# EAGLE design radiomatrix (EAGLE 6.2)
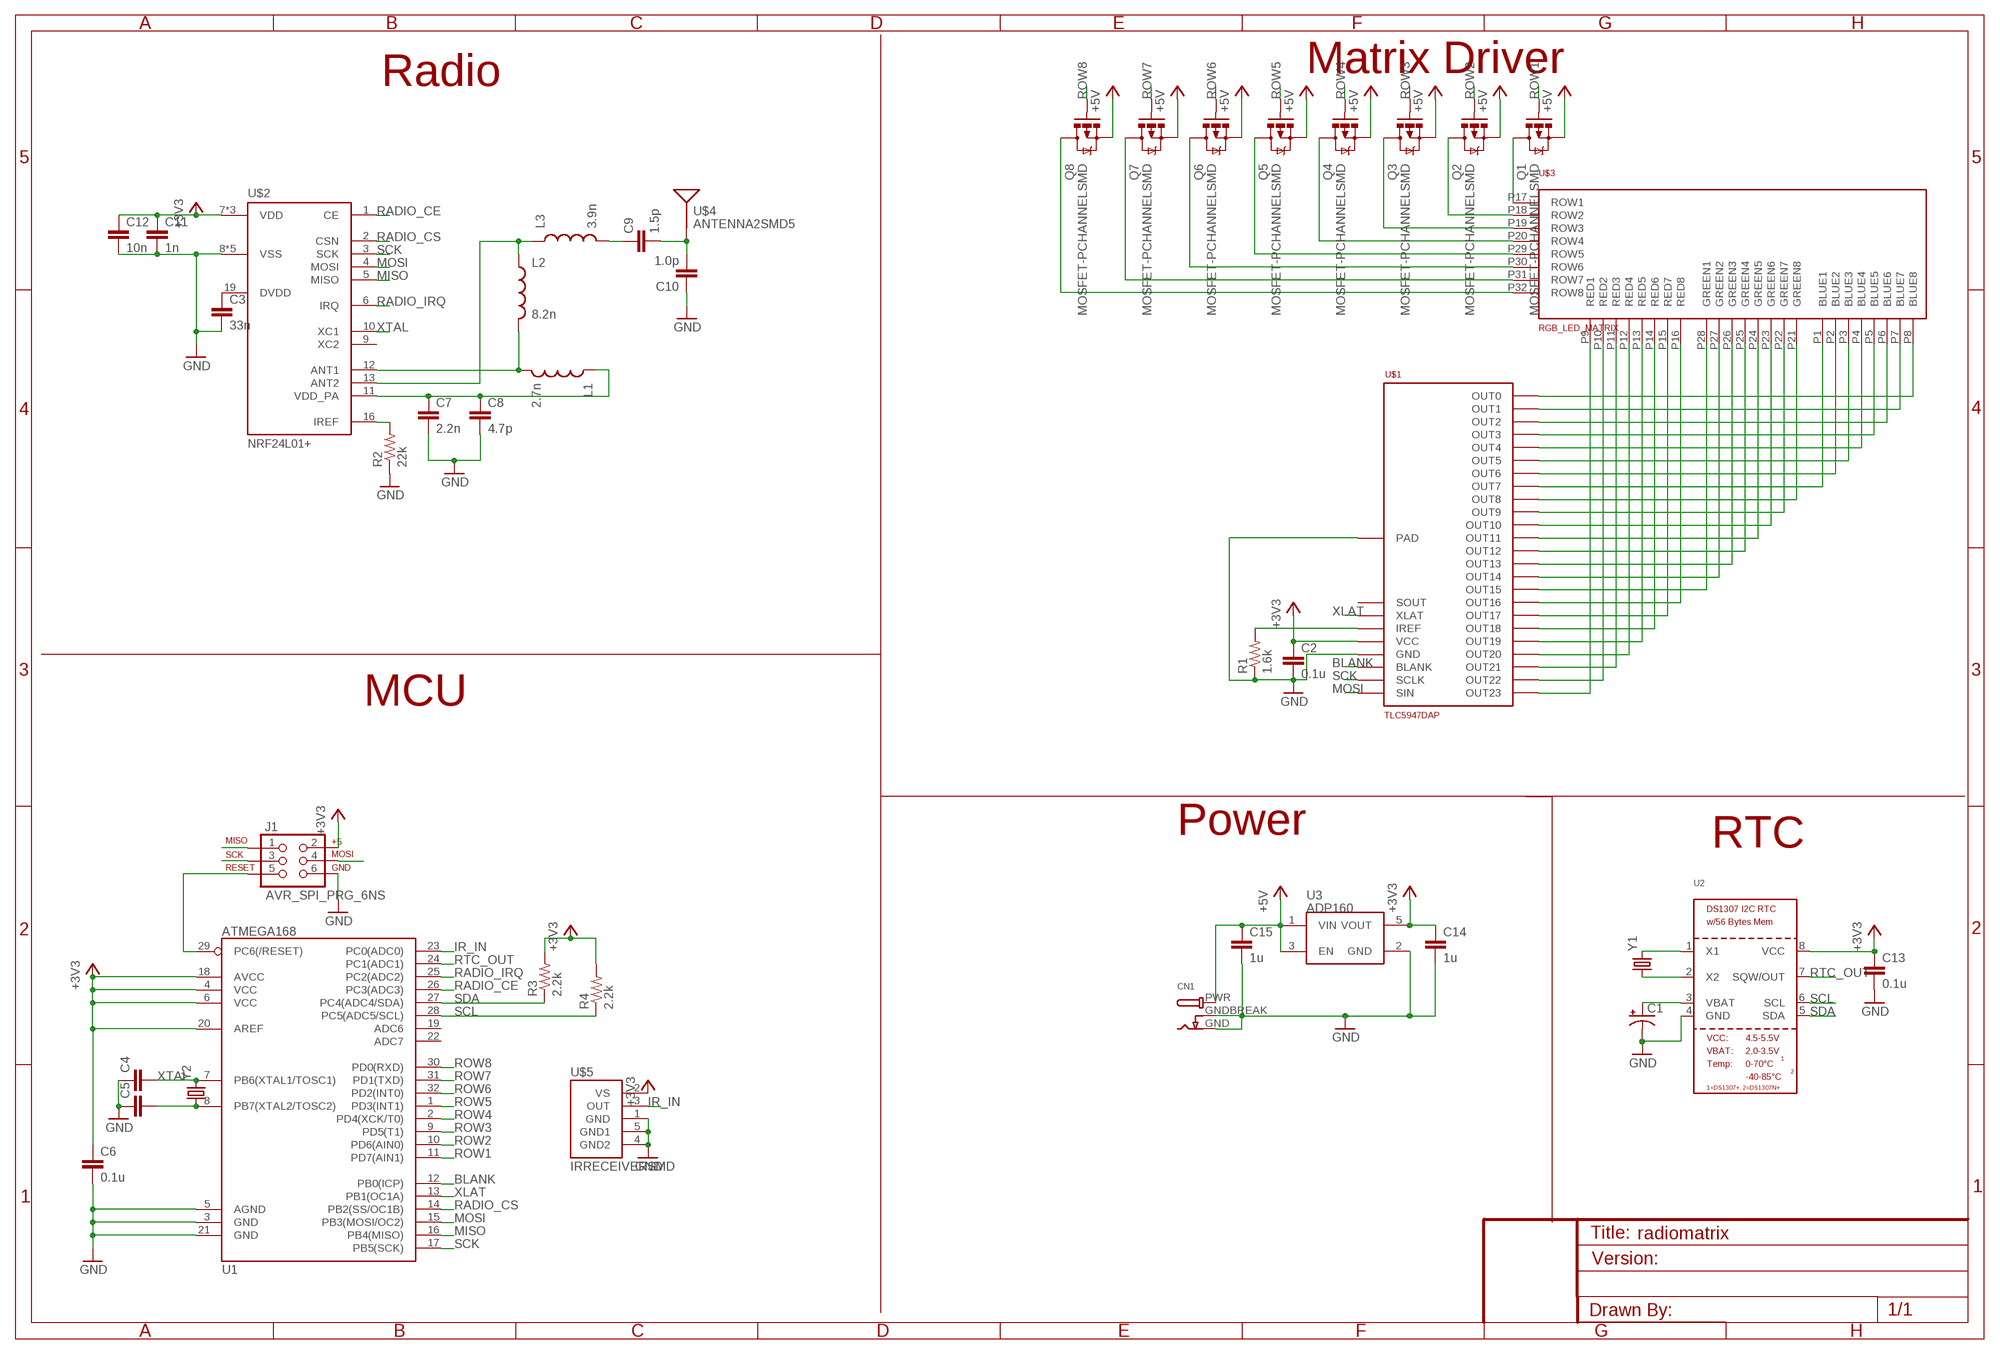
[diagram p0: schematic, sheet 1]

## Parts
C1  SUPERCAP  [414-VA5R]
C2  0.1u  CAP0603-CAP  [0603-CAP]
C3  33n  CAP0603-CAP  [0603-CAP]
C4  CAP0603-CAP  [0603-CAP]
C5  CAP0603-CAP  [0603-CAP]
C6  0.1u  CAP0603-CAP  [0603-CAP]
C7  2.2n  CAP0603-CAP  [0603-CAP]
C8  4.7p  CAP0603-CAP  [0603-CAP]
C9  1.5p  CAP0603-CAP  [0603-CAP]
C10  1.0p  CAP0603-CAP  [0603-CAP]
C11  1n  CAP0603-CAP  [0603-CAP]
C12  10n  CAP0603-CAP  [0603-CAP]
C13  0.1u  CAP0603-CAP  [0603-CAP]
C14  1u  CAP0603-CAP  [0603-CAP]
C15  1u  CAP0603-CAP  [0603-CAP]
CN1  DCBARREL1.3MM  [DCJACK_1.3MM_PTH]
J1  AVR_SPI_PRG_6NS  [2X3-NS]
L1  2.7n  INDUCTOR0603  [0603]
L2  8.2n  INDUCTOR0603  [0603]
L3  3.9n  INDUCTOR0603  [0603]
Q1  MOSFET-PCHANNELSMD  [SOT23-3]
Q2  MOSFET-PCHANNELSMD  [SOT23-3]
Q3  MOSFET-PCHANNELSMD  [SOT23-3]
Q4  MOSFET-PCHANNELSMD  [SOT23-3]
Q5  MOSFET-PCHANNELSMD  [SOT23-3]
Q6  MOSFET-PCHANNELSMD  [SOT23-3]
Q7  MOSFET-PCHANNELSMD  [SOT23-3]
Q8  MOSFET-PCHANNELSMD  [SOT23-3]
R1  1.6k  RESISTOR0603-RES  [0603-RES]
R2  22k  RESISTOR0603-RES  [0603-RES]
R3  2.2k  RESISTOR0603-RES  [0603-RES]
R4  2.2k  RESISTOR0603-RES  [0603-RES]
U1  ATMEGA168  [TQFP32-08]
U2  RTC_DS1307  [SOIC8_150MIL]
U3  ADP160  [SOT23-5]
U$1  TLC5947DAP  [HTSSOP32DAP]
U$2  NRF24L01+  [QFN20]
U$3  RGB_LED_MATRIX  [RGB_LED_MATRIX_60MM]
U$4  ANTENNA2SMD5  [ANTENNA-CHIP5]
U$5  IRRECEIVERSMD  [TSOP8523]
Y1  CRYSTAL32-SMD  [CRYSTAL-32KHZ-SMD]
Y2  CRYSTAL5X3  [CRYSTAL-SMD-5X3]

## Nets
+3V3: C2.1 C6.1 C11.1 C12.1 C13.1 C14.1 J1.2 R3.2 R4.2 U1.4(VCC) U1.6(VCC) U1.18(AVCC) U1.20(AREF) U2.8(VCC) U3.5(VOUT) U$1.32(VCC) U$2.7(VDD) U$2.15(VDD) U$2.18(VDD) U$5.2(VS)
+5V: C15.1 CN1.PWR Q1.2(S) Q2.2(S) Q3.2(S) Q4.2(S) Q5.2(S) Q6.2(S) Q7.2(S) Q8.2(S) U3.1(VIN) U3.3(EN)
ANT1: L1.2 L2.2 U$2.12(ANT1)
ANT2: L2.1 L3.1 U$2.13(ANT2)
ANT2B: C9.1 L3.2
ANT2C: C9.2 C10.2 U$4.FEED(SIGNAL)
BLANK: U1.12(PB0(ICP)) U$1.2(BLANK)
BLUE1: U$1.12(OUT7) U$3.P1(BLUE1)
BLUE2: U$1.11(OUT6) U$3.P2(BLUE2)
BLUE3: U$1.10(OUT5) U$3.P3(BLUE3)
BLUE4: U$1.9(OUT4) U$3.P4(BLUE4)
BLUE5: U$1.8(OUT3) U$3.P5(BLUE5)
BLUE6: U$1.7(OUT2) U$3.P6(BLUE6)
BLUE7: U$1.6(OUT1) U$3.P7(BLUE7)
BLUE8: U$1.5(OUT0) U$3.P8(BLUE8)
GND: C1.- C2.2 C3.2 C4.1 C5.1 C6.2 C7.2 C8.2 C10.1 C11.2 C12.2 C13.2 C14.2 C15.2 CN1.GND CN1.GNDBREAK J1.6 R1.1 R2.1 U1.3(GND) U1.5(AGND) U1.21(GND) U2.4(GND) U3.2(GND) U$1.1(GND) U$1.EXP(PAD) U$2.8(VSS) U$2.14(VSS) U$2.17(VSS) U$2.20(VSS) U$2.EXP(VSS) U$5.1(GND) U$5.4(GND2) U$5.5(GND1)
GREEN1: U$1.20(OUT15) U$3.P28(GREEN1)
GREEN2: U$1.19(OUT14) U$3.P27(GREEN2)
GREEN3: U$1.18(OUT13) U$3.P26(GREEN3)
GREEN4: U$1.17(OUT12) U$3.P25(GREEN4)
GREEN5: U$1.16(OUT11) U$3.P24(GREEN5)
GREEN6: U$1.15(OUT10) U$3.P23(GREEN6)
GREEN7: U$1.14(OUT9) U$3.P22(GREEN7)
GREEN8: U$1.13(OUT8) U$3.P21(GREEN8)
IR_IN: U1.23(PC0(ADC0)) U$5.3(OUT)
MISO: J1.1 U1.16(PB4(MISO)) U$2.5(MISO)
MOSI: J1.4 U1.15(PB3(MOSI/OC2)) U$1.4(SIN) U$2.4(MOSI)
N$1: C1.+ U2.3(VBAT)
N$2: U2.2(X2) Y1.X1
N$3: U2.1(X1) Y1.X2
N$36: R1.2 U$1.31(IREF)
N$37: C3.1 U$2.19(DVDD)
N$38: C7.1 C8.1 L1.1 U$2.11(VDD_PA)
N$39: C5.2 U1.8(PB7(XTAL2/TOSC2)) Y2.1
N$40: J1.5 U1.29(PC6(/RESET))
N$46: R2.2 U$2.16(IREF)
R1: Q1.3(D) U$3.P17(ROW1)
R2: Q2.3(D) U$3.P18(ROW2)
R3: Q3.3(D) U$3.P19(ROW3)
R4: Q4.3(D) U$3.P20(ROW4)
R5: Q5.3(D) U$3.P29(ROW5)
R6: Q6.3(D) U$3.P30(ROW6)
R7: Q7.3(D) U$3.P31(ROW7)
R8: Q8.3(D) U$3.P32(ROW8)
RADIO_CE: U1.26(PC3(ADC3)) U$2.1(CE)
RADIO_CS: U1.14(PB2(SS/OC1B)) U$2.2(CSN)
RADIO_IRQ: U1.25(PC2(ADC2)) U$2.6(IRQ)
RED1: U$1.28(OUT23) U$3.P9(RED1)
RED2: U$1.27(OUT22) U$3.P10(RED2)
RED3: U$1.26(OUT21) U$3.P11(RED3)
RED4: U$1.25(OUT20) U$3.P12(RED4)
RED5: U$1.24(OUT19) U$3.P13(RED5)
RED6: U$1.23(OUT18) U$3.P14(RED6)
RED7: U$1.22(OUT17) U$3.P15(RED7)
RED8: U$1.21(OUT16) U$3.P16(RED8)
ROW1: Q1.1(G) U1.11(PD7(AIN1))
ROW2: Q2.1(G) U1.10(PD6(AIN0))
ROW3: Q3.1(G) U1.9(PD5(T1))
ROW4: Q4.1(G) U1.2(PD4(XCK/T0))
ROW5: Q5.1(G) U1.1(PD3(INT1))
ROW6: Q6.1(G) U1.32(PD2(INT0))
ROW7: Q7.1(G) U1.31(PD1(TXD))
ROW8: Q8.1(G) U1.30(PD0(RXD))
RTC_OUT: U1.24(PC1(ADC1)) U2.7(SQW/OUT)
SCK: J1.3 U1.17(PB5(SCK)) U$1.3(SCLK) U$2.3(SCK)
SCL: R4.1 U1.28(PC5(ADC5/SCL)) U2.6(SCL)
SDA: R3.1 U1.27(PC4(ADC4/SDA)) U2.5(SDA)
XLAT: U1.13(PB1(OC1A)) U$1.30(XLAT)
XTAL: C4.2 U1.7(PB6(XTAL1/TOSC1)) U$2.10(XC1) Y2.3
Unconnected: U1.19(ADC6) U1.22(ADC7) U$1.29(SOUT) U$2.9(XC2)

## Notes on the sheet
- Radio | Matrix Driver
- MCU
- Power | RTC

## Library data of the parts
C1 = adafruit:SUPERCAP
C2-C15 = SparkFun-Passives:CAP: Capacitor Standard 0603 ceramic capacitor, and 0.1" leaded capacitor.
CN1 = microbuilder:DCBARREL: DC Barrel Jack DCJACK_1.3MM_PTH - Through Hole 1.3mm Jack (4UConnector: 05536) DCJACK_2MM_PTH - Through Hole 2.0/2.1 Jack (4UConnector: 05537) DCJACK_2MM_SMT - SMT 2.0/2.1mm Jack(4UConnector: 03267)
J1 = SparkFun-Connectors:AVR_SPI_PRG_6: AVR ISP 6 Pin This is the reduced ISP connector for AVR programming. Common on Arduino. This footprint will take up less PCB space and can be used with a 10-pin to 6-pin adapter such as SKU: BOB-08508
L1-L3 = SparkFun-Passives:INDUCTOR: Inductors Basic Inductor/Choke - 0603 and 1206. Footprints are not proven and vary greatly between part numbers.
Q1-Q8 = SparkFun-DiscreteSemi:MOSFET-PCHANNEL: Generic PMOSFET
R1-R4 = SparkFun-Passives:RESISTOR: Resistor Basic schematic elements and footprints for 0603, 1206, and PTH resistors.
U1 = SparkFun-DigitalIC:ATMEGA168: Atmel 32-pin 8-bit micro, 16k flash.
U2 = microbuilder:RTC_DS1307: DS1307 I2C RTC with 56-Bytes RAM
U3 = SparkFun-PowerIC:ADP160: Nanopower LDO Iq less than 1uA for low Iload; PROD_ID: VREG-11306
U$1 = TLC5947:TLC5947
U$2 = nRF24L01+:NRF24L01+
U$3 = nickparts:RGB_LED_MATRIX
U$4 = SparkFun-RF:ANTENNA2: Chip antenna Single endded antenna. Common with smaller chip antennas. CHIP4 package is the GPS Chip Antenna SKU: GPS-08418. CHIP5 package is 2.4GHz chip antenna SKU: WRL-00144.
U$5 = SparkFun-Sensors:IRRECEIVER: TSOP85238 38kHz IR receiver with built in demodulation and filtering- SEN-08545
Y1 Y2 = SparkFun-FreqCtrl:CRYSTAL: Various standard crystals. Proven footprints. Spark Fun Electronics SKU : COM-00534

## Board
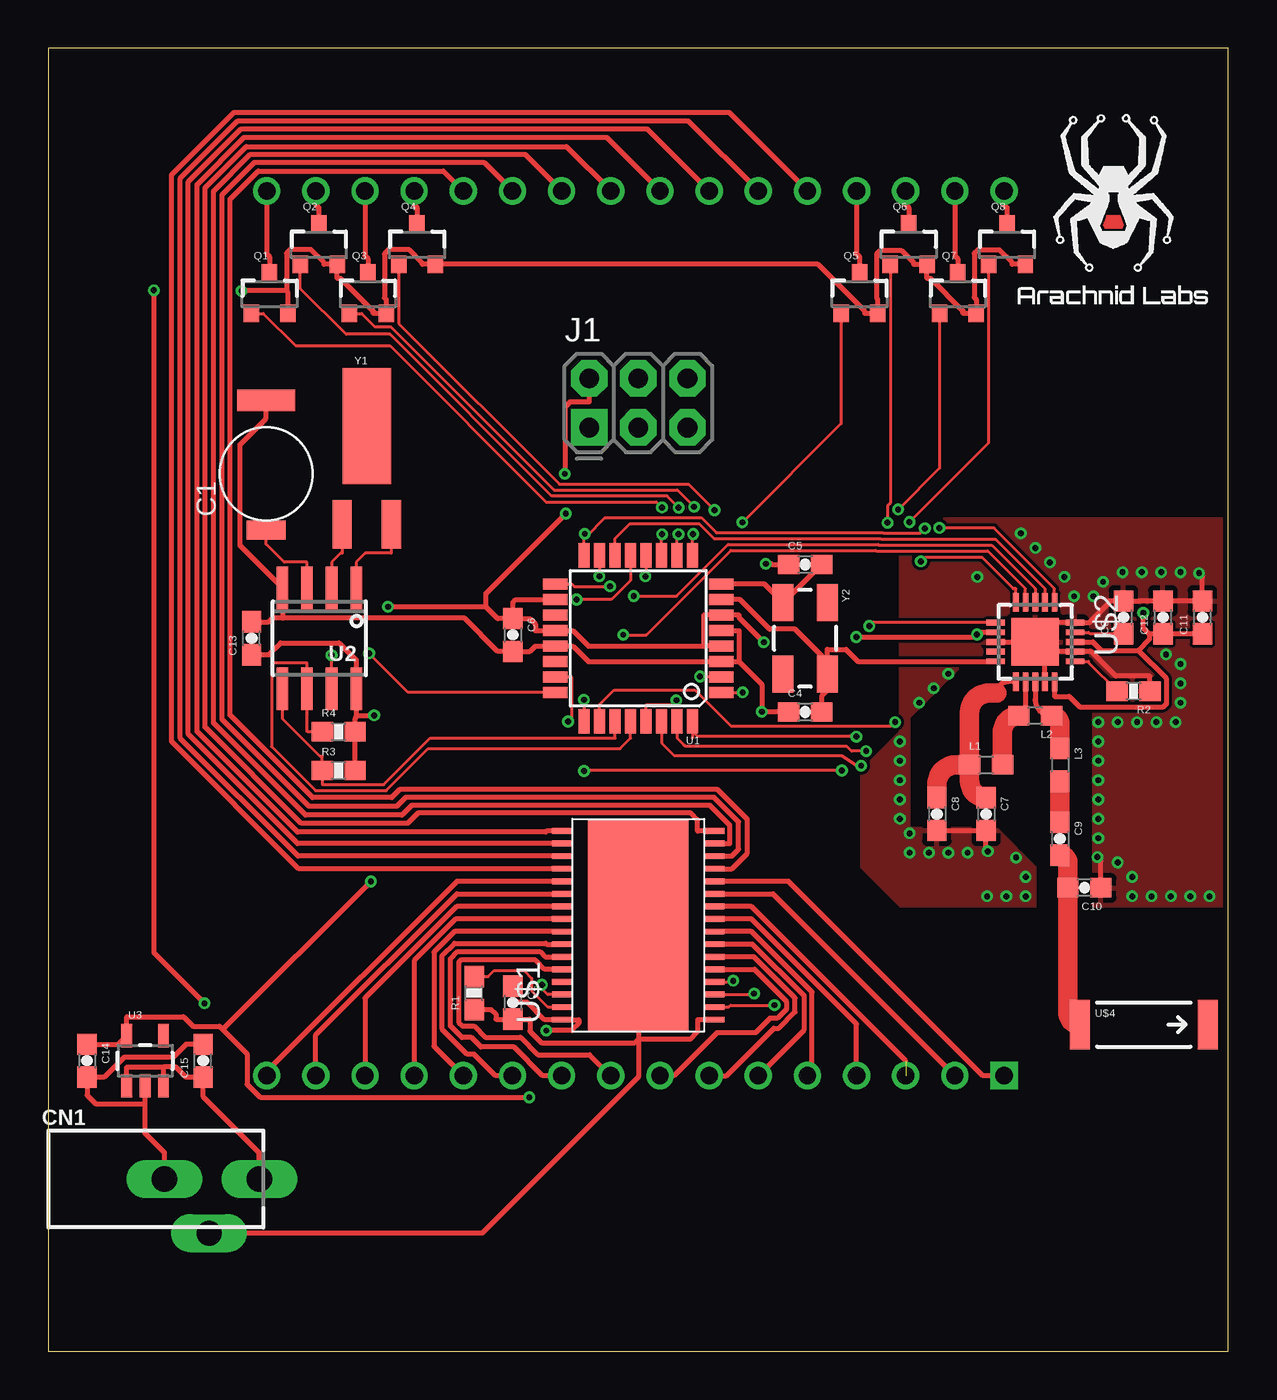
[diagram p1: board, top side]
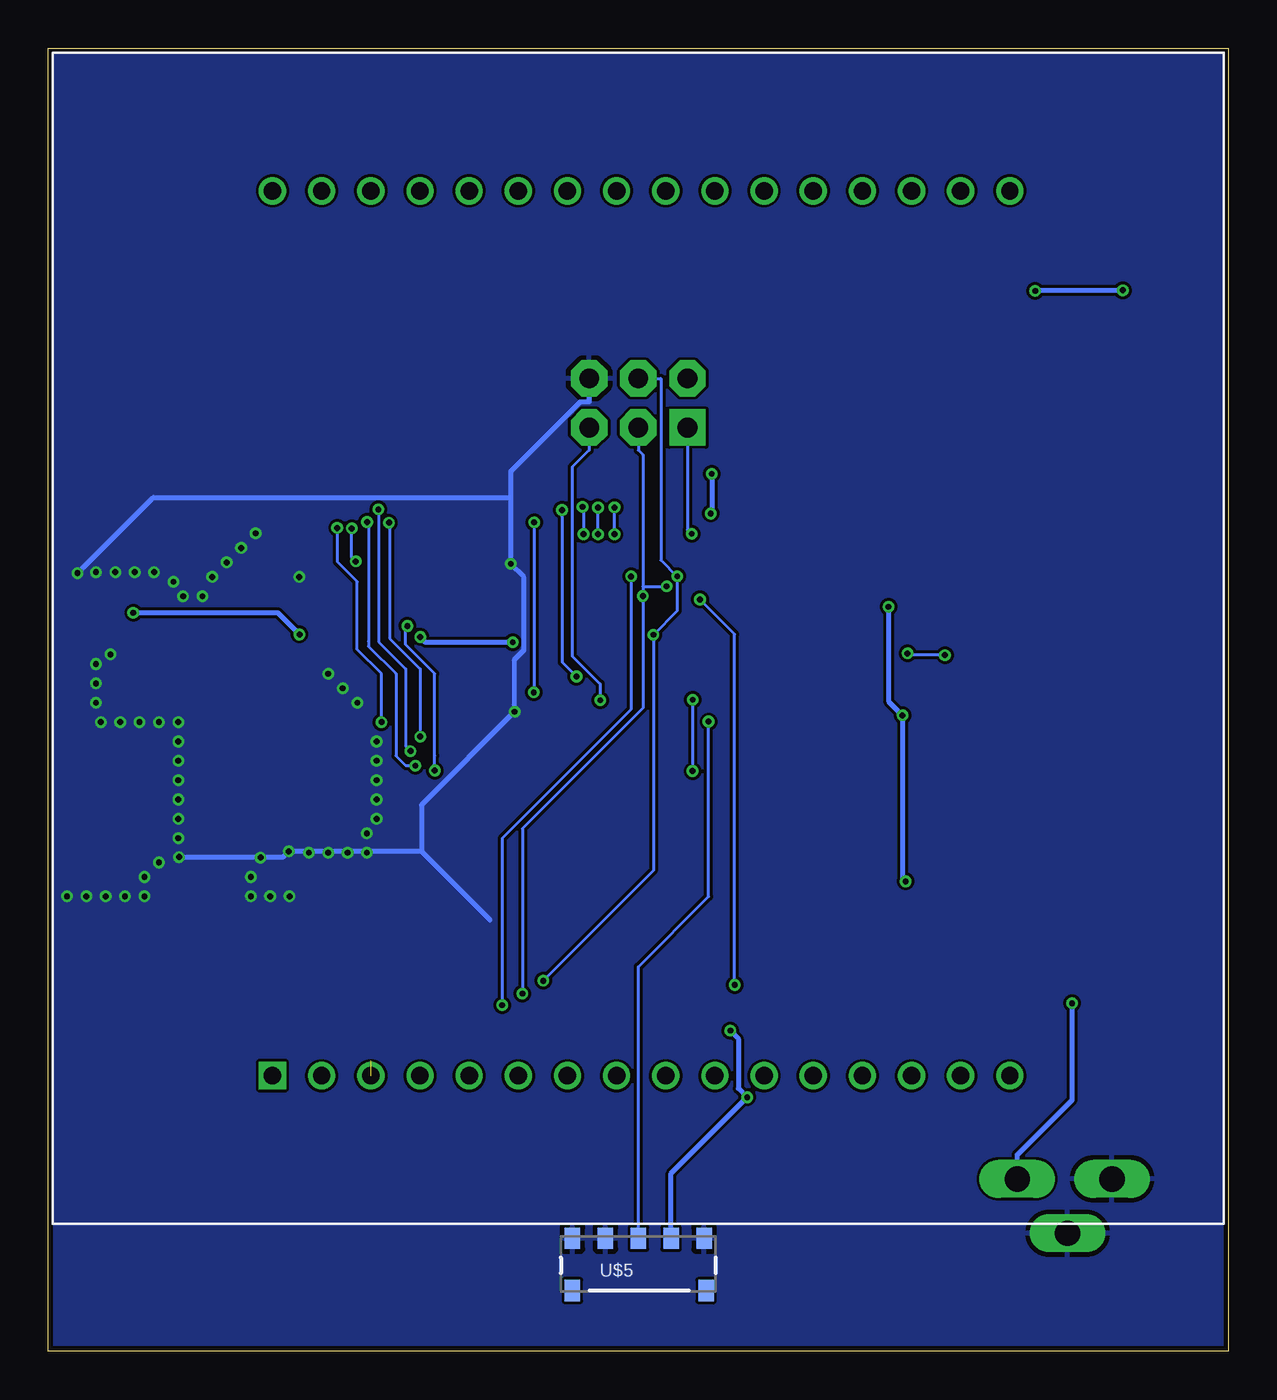
[diagram p2: board, bottom side, seen from below]

Size 60.96 x 67.31 mm. Coordinates in mm from the lower left corner, seen from the top.
Outline: 0,0 60.96,0 60.96,67.31 0,67.31 0,0
Copper layers (1*16): Top 0.035mm / dielectric 1.5mm / Bottom 0.035mm
Design rules: minimum track width 6mil, minimum drill 0.3mm, track to track 6mil, track to pad 6mil, pad to pad 6mil, via to via 6mil, smd to smd 0mil, copper to edge 10mil, drill to drill 10mil, minimum pad ring 10mil, minimum via ring 0.15mm, stop-mask expansion 2mil, vias tented up to drill 100mil, thermal gap 10mil
tKeepout: area 51,0 to 61,23
bKeepout: area 51,0 to 61,23

### Footprints (pad centres in the part's own frame; a part is rotated, then mirrored left to right if it is on the bottom)
414-VA5R = smd 1 x 2: + -2.9,0 | smd 1.1 x 3: - 3.8,0
0603-CAP = smd 1.1 x 1: 1 -0.85,0; 2 0.85,0
DCJACK_1.3MM_PTH = drill 1.3 long: GND 0,6; GNDBREAK 2.8,8.3; PWR 0,10.9
2X3-NS = drill 1.016 pad 1.88 square: 1 -2.54,-1.27 | drill 1.016 pad 1.88 octagon: 2 -2.54,1.27; 3 0,-1.27; 4 0,1.27; 5 2.54,-1.27; 6 2.54,1.27
0603 = smd 1.1 x 1: 1 -0.85,0; 2 0.85,0
SOT23-3 = smd 0.8 x 0.9: 1 -0.95,-1; 2 0.95,-1; 3 0,1.1
0603-RES = smd 1.1 x 1: 1 -0.85,0; 2 0.85,0
TQFP32-08 = smd 1.27 x 0.559: 1 -4.293,2.8; 2 -4.293,2; 3 -4.293,1.2; 4 -4.293,0.4; 5 -4.293,-0.4; 6 -4.293,-1.2; 7 -4.293,-2; 8 -4.293,-2.8; 17 4.293,-2.8; 18 4.293,-2; 19 4.293,-1.2; 20 4.293,-0.4; 21 4.293,0.4; 22 4.293,1.2; 23 4.293,2; 24 4.293,2.8 | smd 0.559 x 1.27: 9 -2.8,-4.293; 10 -2,-4.293; 11 -1.2,-4.293; 12 -0.4,-4.293; 13 0.4,-4.293; 14 1.2,-4.293; 15 2,-4.293; 16 2.8,-4.293; 25 2.8,4.293; 26 2,4.293; 27 1.2,4.293; 28 0.4,4.293; 29 -0.4,4.293; 30 -1.2,4.293; 31 -2,4.293; 32 -2.8,4.293
SOIC8_150MIL = smd 0.6 x 2.2: 1 -1.905,-2.6; 2 -0.635,-2.6; 3 0.635,-2.6; 4 1.905,-2.6; 5 1.905,2.6; 6 0.635,2.6; 7 -0.635,2.6; 8 -1.905,2.6
SOT23-5 = smd 0.55 x 1.2: 1 -0.95,-1.3; 2 0,-1.3; 3 0.95,-1.3; 4 0.95,1.3; 5 -0.95,1.3
HTSSOP32DAP = smd 0.3 x 1: 1 -4.875,-3.95; 2 -4.225,-3.95; 3 -3.575,-3.95; 4 -2.925,-3.95; 5 -2.275,-3.95; 6 -1.625,-3.95; 7 -0.975,-3.95; 8 -0.325,-3.95; 9 0.325,-3.95; 10 0.975,-3.95; 11 1.625,-3.95; 12 2.275,-3.95; 13 2.925,-3.95; 14 3.575,-3.95; 15 4.225,-3.95; 16 4.875,-3.95; 17 4.875,3.95; 18 4.225,3.95; 19 3.575,3.95; 20 2.925,3.95; 21 2.275,3.95; 22 1.625,3.95; 23 0.975,3.95; 24 0.325,3.95; 25 -0.325,3.95; 26 -0.975,3.95; 27 -1.625,3.95; 28 -2.275,3.95; 29 -2.925,3.95; 30 -3.575,3.95; 31 -4.225,3.95; 32 -4.875,3.95 | smd 11 x 5.2: EXP 0,0
QFN20 = smd 0.95 x 0.3: 1 -2.05,1; 2 -2.05,0.5; 3 -2.05,0; 4 -2.05,-0.5; 5 -2.05,-1; 11 2.05,-1; 12 2.05,-0.5; 13 2.05,0; 14 2.05,0.5; 15 2.05,1 | smd 0.3 x 0.95: 6 -1,-2.05; 7 -0.5,-2.05; 8 0,-2.05; 9 0.5,-2.05; 10 1,-2.05; 16 1,2.05; 17 0.5,2.05; 18 0,2.05; 19 -0.5,2.05; 20 -1,2.05 | smd 2.45 x 2.45: EXP 0,0
RGB_LED_MATRIX_60MM = drill 0.9 square: P1 -18.9,-22.6 | drill 0.9: P2 -16.36,-22.6; P3 -13.82,-22.6; P4 -11.28,-22.6; P5 -8.74,-22.6; P6 -6.2,-22.6; P7 -3.66,-22.6; P8 -1.12,-22.6; P9 1.42,-22.6; P10 3.96,-22.6; P11 6.5,-22.6; P12 9.04,-22.6; P13 11.58,-22.6; P14 14.12,-22.6; P15 16.66,-22.6; P16 19.2,-22.6; P17 19.2,23.12; P18 16.66,23.12; P19 14.12,23.12; P20 11.58,23.12; P21 9.04,23.12; P22 6.5,23.12; P23 3.96,23.12; P24 1.42,23.12; P25 -1.12,23.12; P26 -3.66,23.12; P27 -6.2,23.12; P28 -8.74,23.12; P29 -11.28,23.12; P30 -13.82,23.12; P31 -16.36,23.12; P32 -18.9,23.12
ANTENNA-CHIP5 = smd 1.016 x 2.54: FEED -3.302,0; NC 3.302,0
TSOP8523 = smd 0.8 x 1.1: 1 3.4,0; 2 1.7,0; 3 0,0; 4 -1.7,0; 5 -3.4,0; P$1 -3.4,-2.7; P$2 3.5,-2.7
CRYSTAL-32KHZ-SMD = smd 2.5 x 6: SHEILD 0,5.08 | smd 1 x 2.5: X1 -1.27,0; X2 1.27,0
CRYSTAL-SMD-5X3 = smd 1.9 x 1.1: 1 -1.85,-1.15; 2 1.85,-1.15; 3 1.85,1.15; 4 -1.85,1.15

### Placement (x,y rotation side)
C1  11.25,45.32 90 top
C2  24,18 270 top
C3  55.55,37.91 90 top
C4  39.1,33.02 0 top
C5  39.1,40.64 0 top
C6  24,37 270 top
C7  48.45,27.75 270 top
C8  45.91,27.75 270 top
C9  52.26,26.48 270 top
C10  53.53,23.94 180 top
C11  59.63,37.91 90 top
C12  57.59,37.91 90 top
C13  10.5,36.83 90 top
C14  2,15 270 top
C15  8,15 90 top
CN1  0,8.89 270 top
J1  30.48,48.99 0 top
L1  48.45,30.29 0 top
L2  50.99,32.83 180 top
L3  52.26,30.29 270 top
Q1  11.43,54.61 0 top
Q2  13.97,57.15 0 top
Q3  16.51,54.61 0 top
Q4  19.05,57.15 0 top
Q5  41.91,54.61 0 top
Q6  44.45,57.15 0 top
Q7  46.99,54.61 0 top
Q8  49.53,57.15 0 top
R1  22,18.5 90 top
R2  56.07,34.1 180 top
R3  15,30 0 top
R4  15,32 0 top
U1  30.48,36.83 180 top
U2  14,36.83 180 top
U3  5,15 0 top
U$1  30.48,22 90 top
U$2  50.99,36.64 270 top
U$3  30.48,36.83 0 bottom
U$4  56.6,16.87 0 top
U$5  30.48,5.83 0 bottom
U$6  [ARACHNID_LABS_LOGO_SM]  55,59 0 top
Y1  16.45,42.71 0 top
Y2  39.1,36.83 270 top

### Tracks (layer width: path | path; a pad name or v marks a point on that pad's centre or on a via)
+3V3  (via drill 0.3 pad 0.6)
  Top 0.254: 56.89,37.06 56.58,37.37 v56.58,38.15 | 56.89,37.06 56.89,36.79 56.31,36.21 | 56.89,37.06 C12.1 C11.1 | U$2.15 51.99,33.84 52.74,33.84 53.29,33.29 57.62,33.29 57.78,33.45 57.78,34.74 56.31,36.21 | 22.61,38.46 22.61,39.16 v26.74,43.28 | 22.61,38.46 v17.55,38.46 | J1.2 27.94,49.04 26.95,49.04 26.68,48.78 v26.68,45.33 | C6.1 23.22,37.85 22.61,38.46 | C6.1 24,38.68 24.15,38.83 U1.18 | 9.01,16.62 10.26,15.36 10.26,13.79 10.94,13.11 v24.85,13.11 | v16.66,24.27 9.01,16.62 | 15.9,32.85 v16.82,32.85 v16.83,32.85 | 15.9,32.85 U2.8 15.9,35.71 15.02,36.6 12,36.6 11.38,35.98 C13.1 | v36.97,36.62 35.69,37.9 35.69,38.03 U1.6 33.86,38.03 33.86,36.43 | U$2.7 48.1,37.14 v47.98,37.03 47.83,36.87 41.77,36.87 v41.75,36.9 | 33.86,36.43 27.9,36.43 27.1,37.23 U1.20 25.17,37.23 25.17,37.56 24.88,37.85 C6.1 | U1.4 33.86,36.43 | U$2.18 53.97,36.64 54.4,36.21 56.31,36.21 | R3.2 R4.2 15.85,32.69 15.9,32.75 15.9,32.85 | 9.01,16.62 8.84,16.79 7.47,16.79 6.98,17.28 4.05,17.28 U3.5 3.6,15.85 C14.1 | v25.72,16.56 27.03,16.56 27.41,16.94 27.41,17.12 U$1.32 25.65,17.12 24.75,18.02 24,18.02 C2.1
  Bottom 0.254: v56.58,38.15 49.11,38.15 v47.98,37.03 | v26.68,45.33 26.68,43.33 v26.74,43.28 | v17.55,38.46 17.55,33.57 v16.83,32.85 16.83,24.43 v16.66,24.27 | U$5.2 28.78,9.19 v24.85,13.11 25.3,13.56 25.3,16.14 v25.72,16.56 | v36.97,36.62 41.47,36.62 v41.75,36.9
+5V  (via drill 0.3 pad 0.6)
  Top 0.254: v5.44,54.81 5.44,20.59 v8.06,17.97 | 12.3,54.78 v9.97,54.78 | Q1.2 12.38,54.71 12.3,54.78 | 12.3,54.78 12.3,56.73 12.49,56.91 13.56,56.91 14.24,56.23 14.24,56.15 Q2.2 14.92,55.42 15.11,55.42 16.78,53.74 16.78,53.61 Q3.2 17.46,54.34 17.37,54.43 17.37,56.7 17.57,56.9 18.65,56.9 19.32,56.23 19.32,56.15 Q4.2 39.76,56.15 42.18,53.73 42.18,53.61 Q5.2 42.86,54.34 42.82,54.38 42.82,56.72 42.99,56.88 44.07,56.88 44.72,56.23 44.72,56.15 Q6.2 45.4,55.42 45.59,55.42 47.26,53.75 47.26,53.61 Q7.2 47.94,54.34 47.84,54.43 47.84,56.72 48.02,56.89 49.14,56.89 49.8,56.23 49.8,56.15 Q8.2 | CN1.PWR 10.9,10.25 8,13.15 C15.1 7.12,14.15 6.59,14.68 5.95,14.68 | U3.3 5.95,14.68 | U3.1 4.05,14.68 5.95,14.68
  Bottom 0.254: CN1.PWR 10.9,10.14 8.06,12.98 v8.06,17.97 | v9.97,54.78 9.94,54.81 v5.44,54.81
ANT1
  Top 0.254: U$2.12 50.49,33.18 arc-90 L2.2
  Top 1: L2.2 arc90 49.3,31.99 L1.2
ANT2
  Top 0.254: U$2.13 50.99,33.68 arc90 L2.1
  Top 1: L2.1 arc-90 52.26,32.41 L3.1
ANT2B
  Top 1: L3.2 C9.1
ANT2C
  Top 1: C9.2 arc-90 52.68,25.21 C10.2 52.68,17.49 arc90 U$4.FEED
BLANK  (via drill 0.3 pad 0.6)
  Top 0.152: U1.12 30.88,40.06 v30.85,40.03 | U$1.2 35.16,17.77 35.26,17.87 v37.51,17.87
  Bottom 0.152: v30.85,40.03 30.85,33.16 37.51,26.5 v37.51,17.87
BLUE1
  Top 0.254: U$3.P1 48.3,14.23 38.25,24.27 U$1.12
BLUE2
  Top 0.254: U$1.11 37.45,23.62 U$3.P2
BLUE3  (1 unrouted)
  Top 0.254: 44.3,14.99 36.32,22.98 U$1.10
BLUE4
  Top 0.254: U$3.P4 41.76,16.9 36.33,22.32 U$1.9
BLUE5
  Top 0.254: U$3.P5 39.47,14.48 39.47,18.55 36.34,21.68 U$1.8
BLUE6
  Top 0.254: U$3.P6 39.06,16.61 39.06,18.36 36.39,21.02 U$1.7
BLUE7
  Top 0.254: U$3.P7 35.03,14.23 37.49,16.68 37.75,16.68 38.58,17.52 38.58,18.25 36.45,20.38 U$1.6
BLUE8
  Top 0.254: U$1.5 36.48,19.73 38.13,18.08 38.13,17.66 37.67,17.19 37.28,17.19 36.53,16.45 34.54,16.45 32.32,14.23 U$3.P8
GND  (via drill 0.3 pad 0.6)
  Top 0.254: R2.1 56.92,34.88 55.16,34.88 53.9,36.14 U$2.17 51.49,36.14 | v59.45,40.2 59.63,40.02 C11.2 C12.2 56.33,38.76 C3.2 54.77,38.76 54.77,38.62 53.79,37.64 U$2.20 51.99,37.64 U$2.EXP | v37.07,40.68 37.38,40.68 37.42,40.64 C5.1 | 35.69,35.63 36.87,34.45 v36.87,33.04 36.89,33.02 C4.1 | 35.69,35.63 U1.3 27.9,35.63 27.1,36.43 U1.21 25.16,36.43 24.88,36.15 C6.2 23.22,36.15 21.49,37.88 12.13,37.88 12.1,37.91 | U1.5 35.69,37.23 35.69,35.63 | C8.2 C7.2 48.45,25.91 v48.54,25.82 | C10.1 54.38,25.35 v54.21,25.53 | 5,12.78 U3.2 | 51.49,36.14 U$2.EXP | U$2.14 51.49,36.14 | U$2.8 U$2.EXP | 12.1,37.91 U2.4 9.9,41.62 9.9,46.84 11.25,48.19 C1.- | C13.2 11.38,37.68 11.61,37.91 12.1,37.91 | C15.2 7.12,15.85 6.46,15.19 3.92,15.19 2.88,14.15 C14.2 2,13.22 2.44,12.78 5,12.78 | CN1.GND 6,10.25 5,11.25 5,12.78 | 30.48,16.12 30.48,14.16 22.41,6.09 CN1.GNDBREAK | U$1.1 33.55,17.12 33.55,16.51 33.16,16.12 30.48,16.12 | U$1.EXP 30.48,16.12 | 30.48,16.12 30.3,15.94 25.47,15.94 24.88,16.53 24.88,17.15 C2.2 23.12,17.15 23.12,17.41 22.88,17.65 R1.1
  Bottom 0.254: 41.69,25.82 38.14,22.28 | 41.69,25.82 41.69,28.22 v36.87,33.04 36.87,35.74 36.39,36.22 36.39,39.99 v37.07,40.68 37.07,44.11 | 41.69,25.82 v48.54,25.82 48.84,25.53 v54.21,25.53 | J1.6 33.02,49.04 33.48,49.04 37.07,45.45 37.07,44.11 | v59.45,40.2 55.54,44.11 37.07,44.11
  other vias: 44.5,25.75 45.5,25.75 46.5,25.75 47.5,25.75 50,25.5 50.5,24.5 48.5,23.5 49.5,23.5 50.5,23.5 44.5,26.75 44,27.5 44,28.5 44,29.5 44,30.5 44,31.5 45,33.5 45.75,34.25 46.5,35 60,23.5 59,23.5 58,23.5 57,23.5 56,23.5 56,24.5 55.25,25.25 54.25,26.5 54.25,27.5 54.25,28.5 54.25,29.5 54.25,30.5 54.25,31.5 54.25,32.5 55.25,32.5 56.25,32.5 57.25,32.5 58.25,32.5 58.5,33.5 58.5,34.5 58.5,35.5 57.75,36 58.5,40.25 57.5,40.25 56.5,40.25 55.5,40.25 54.5,39.75 54,39 53,39 52.5,40 51.75,40.75 51,41.5 50.25,42.25 48,40
  pour Top: 61,23 61,43 44,43 44,32 42,30 42,25 44,23 51,23 51,25 49,27 44.5,27 44.5,32.75 47.75,36 51.25,36 54,33.25 54,23
  pour Bottom: 0,67 61,67 61,0 0,0
GREEN1
  Top 0.254: U$1.20 12.94,24.93 6.36,31.5 6.36,60.78 9.59,64 35.17,64 U$3.P28
GREEN2
  Top 0.254: U$1.19 12.9,25.57 6.82,31.66 6.82,60.6 9.78,63.57 33.06,63.57 U$3.P27
GREEN3
  Top 0.254: U$1.18 12.88,26.23 7.22,31.88 7.22,60.42 9.97,63.16 30.93,63.16 U$3.P26
GREEN4
  Top 0.254: U$1.17 25.75,26.88 25.7,26.82 12.87,26.82 7.68,32.01 7.68,60.28 10.11,62.71 28.84,62.71 U$3.P25
GREEN5
  Top 0.254: U$1.16 33.55,26.88 33.55,27.45 33.2,27.8 19.09,27.8 18.57,27.27 13.07,27.27 8.1,32.25 8.1,60.11 10.23,62.24 26.77,62.24 U$3.P24
GREEN6
  Top 0.254: U$1.15 35.21,26.23 35.21,27.17 34.18,28.2 18.78,28.2 18.27,27.69 13.28,27.69 8.53,32.45 8.53,59.92 10.44,61.83 24.64,61.83 U$3.P23
GREEN7
  Top 0.254: U$1.14 35.31,25.57 35.66,25.93 35.66,27.35 34.4,28.61 18.47,28.61 18,28.14 13.46,28.14 8.97,32.64 8.97,59.74 10.65,61.42 22.51,61.42 U$3.P22
GREEN8
  Top 0.254: U$1.13 35.31,24.93 36.11,25.73 36.11,27.48 34.58,29.02 18.16,29.02 17.73,28.6 13.65,28.6 9.39,32.86 9.39,59.52 10.84,60.98 20.41,60.98 U$3.P21
IR_IN  (via drill 0.3 pad 0.6)
  Top 0.152: v26.85,32.53 27.05,32.73 27.05,34.83 U1.23
  Bottom 0.152: U$5.3 30.48,19.85 26.85,23.48 v26.85,32.53
MISO  (via drill 0.3 pad 0.6)
  Top 0.152: 27.82,42.13 28.75,43.06 33.74,43.06 34.51,42.29 43.13,42.29 43.14,42.28 45.06,42.28 v45.29,42.51 | U$2.5 49.99,39.39 49.86,39.39 48.25,41 45.28,41 v45.08,40.8 | 27.82,42.13 v27.72,42.23 | U1.16 27.68,41.99 27.82,42.13
  Bottom 0.152: v45.08,40.8 45.29,41.01 v45.29,42.51 | J1.1 27.94,42.45 v27.72,42.23
MOSI  (via drill 0.3 pad 0.6)
  Top 0.152: v29.7,37.01 30.9,37.01 35.26,41.37 42.75,41.37 42.78,41.34 48.54,41.34 50.49,39.39 U$2.4 | U1.15 v28.48,40.04 v28.47,40.03 | U$1.4 35.16,19.07 35.22,19.13 v35.39,19.13 | v35.39,19.13
  Bottom 0.152: v35.39,19.13 29.7,24.82 v29.7,37.01 28.47,38.24 v28.47,40.03 29.31,40.87 29.31,50.26 J1.4
N$1
  Top 0.152: U2.3 13.37,40.76 12.18,40.76 11.25,41.69 C1.+
N$2
  Top 0.152: Y1.X1 15.18,41.23 15.11,41.23 14.63,40.76 U2.2
N$3
  Top 0.152: Y1.X2 17.72,41.23 16.38,41.23 15.9,40.76 U2.1
N$36
  Top 0.152: R1.2 22.73,19.35 23.04,19.66 24.58,19.66 24.97,19.27 24.97,18.61 25.8,17.77 U$1.31
N$37
  Top 0.152: U$2.19 53.74,37.14 53.82,37.06 C3.1
N$38
  Top 0.254: U$2.11 49.59,34.59 arc90 49,34
  Top 1: 49,34 48.6,34 arc90 47.6,33 L1.1 | C7.1 arc-90 47.6,29.45 L1.1 | L1.1 46.91,30.29 arc90 45.91,29.29 C8.1
N$39
  Top 0.254: C5.2 37.99,38.68 Y2.1 37,39.63 U1.8
N$40  (via drill 0.3 pad 0.6)
  Top 0.152: U1.29 30.88,33.4 32.22,33.4 v32.45,33.63
  Bottom 0.152: J1.5 33.02,46.55 33.89,45.68 33.89,35.91 32.45,34.47 v32.45,33.63
N$46
  Top 0.152: U$2.16 53.74,35.64 53.74,35.58 R2.2
R1
  Top 0.254: U$3.P17 11.28,56.69 11.43,56.54 Q1.3
R2
  Top 0.254: U$3.P18 13.82,59.23 13.97,59.08 Q2.3
R3
  Top 0.254: U$3.P19 16.36,56.59 16.51,56.44 Q3.3
R4
  Top 0.254: U$3.P20 18.9,59.23 19.05,59.08 Q4.3
R5
  Top 0.254: U$3.P29 41.76,56.69 41.91,56.54 Q5.3
R6
  Top 0.254: U$3.P30 44.3,59.23 44.45,59.08 Q6.3
R7
  Top 0.254: U$3.P31 46.84,56.59 46.99,56.44 Q7.3
R8
  Top 0.254: U$3.P32 49.38,59.23 49.53,59.08 Q8.3
RADIO_CE  (via drill 0.3 pad 0.6)
  Top 0.152: v46.04,42.53 48.85,42.53 51.99,39.39 U$2.1 | U1.26 28.48,33.4 29.24,34.16 33.41,34.16 35.27,32.29 43.54,32.29 v43.75,32.5
  Bottom 0.152: v46.04,42.53 46.04,40.79 45,39.75 45,36.25 43.75,35 v43.75,32.5
RADIO_CS
  Top 0.152: U$2.2 51.49,39.39 48.93,41.95 43.04,41.95 43.01,41.98 34.39,41.98 33.62,42.75 30.05,42.75 29.28,41.99 U1.14
RADIO_IRQ  (via drill 0.3 pad 0.6)
  Top 0.152: v27.67,33.66 27.67,33.41 27.68,33.4 U1.25 | U$2.6 42.59,37.64 v42.42,37.47 | v41,30 27.7,30 v27.68,29.97
  Bottom 0.152: v27.67,33.66 27.67,30.48 v27.68,29.97 | v41,30 41,30.75 41,35 42.5,36.5 42.5,37.38 v42.42,37.47
RED1
  Top 0.254: U$1.28 25.65,19.73 25.17,20.2 21.32,20.2 21.2,20.09 21.2,16.99 21.39,16.79 21.98,16.79 22.56,16.21 24.39,16.21 25.28,15.32 27.97,15.32 U$3.P9
RED2
  Top 0.254: U$3.P10 25.54,14.23 24.06,15.71 22.35,15.71 21.86,16.2 21.37,16.2 20.78,16.79 20.78,20.27 21.16,20.64 25.4,20.64 25.67,20.38 U$1.27
RED3
  Top 0.254: U$3.P11 23.11,14.23 22.01,15.33 21.64,15.33 20.35,16.62 20.35,20.45 20.98,21.08 25.7,21.08 25.75,21.02 U$1.26
RED4
  Top 0.254: U$1.25 20.98,21.68 19.92,20.62 19.92,15.75 U$3.P12
RED5
  Top 0.254: U$1.24 21.05,22.32 18.9,20.18 U$3.P13
RED6
  Top 0.254: U$1.23 21.1,22.98 16.36,18.24 U$3.P14
RED7
  Top 0.254: U$3.P15 13.82,16.34 21.11,23.62 U$1.22
RED8
  Top 0.254: U$1.21 21.11,24.27 11.28,14.44 U$3.P16
ROW1  (via drill 0.3 pad 0.6)
  Top 0.152: U1.11 31.68,42.18 v31.71,42.21 | Q1.1 11.11,53.61 12.78,51.94 17.65,51.94 25.71,43.88 31.41,43.88 v31.71,43.59
  Bottom 0.152: v31.71,42.21 v31.71,43.59
ROW2  (via drill 0.3 pad 0.6)
  Top 0.152: v32.56,43.59 31.96,44.19 26,44.19 17.65,52.54 15.38,52.54 13.02,54.91 Q2.1 | U1.10 32.48,42.13 v32.56,42.21
  Bottom 0.152: v32.56,42.21 v32.56,43.58 v32.56,43.59
ROW3  (via drill 0.3 pad 0.6)
  Top 0.152: Q3.1 16.19,53.61 16.87,52.93 17.69,52.93 26.13,44.49 32.5,44.49 v33.36,43.63 | U1.9 33.28,42.19 v33.31,42.22
  Bottom 0.152: v33.36,43.63 33.31,43.58 v33.31,42.22
ROW4  (via drill 0.3 pad 0.6)
  Top 0.152: Q4.1 18.1,53.1 26.4,44.8 33.08,44.8 v34.42,43.46 | U1.2 33.7,34.83 v33.67,34.85
  Bottom 0.152: v34.42,43.46 34.42,35.6 v33.67,34.85
ROW5  (via drill 0.3 pad 0.6)
  Top 0.152: Q5.1 40.96,47.92 v35.86,42.82 | U1.1 35.64,34.03 v35.88,34.03
  Bottom 0.152: v35.86,42.82 35.86,34.05 v35.88,34.03
ROW6  (via drill 0.3 pad 0.6)
  Top 0.152: U1.32 33.28,32 | 33.28,32 33.28,31.67 | Q6.1 43.5,43.83 43.36,43.69 v43.36,42.81 | v41.75,31.75 33.53,31.75 33.28,32
  Bottom 0.152: v43.36,42.81 43.33,42.77 43.33,36.83 41.75,35.25 v41.75,31.75
ROW7  (via drill 0.3 pad 0.6)
  Top 0.152: U1.31 32.48,31.67 32.84,31.32 32.9,31.25 41.25,31.25 41.5,31 v42.25,31 | Q7.1 46.04,45.62 v43.91,43.49
  Bottom 0.152: v43.91,43.49 43.89,43.47 43.89,36.64 42.5,35.25 42.5,31.25 v42.25,31
ROW8  (via drill 0.3 pad 0.6)
  Top 0.152: Q8.1 48.58,46.92 v44.49,42.84 | U1.30 31.68,31.67 31.68,31.42 32.35,30.75 41,30.75 41.75,30.25 v42,30.25
  Bottom 0.152: v44.49,42.84 44.42,42.76 44.42,36.67 44.42,36.42 43,35 43,30.75 42.5,30.25 v42,30.25
RTC_OUT  (via drill 0.3 pad 0.6)
  Top 0.152: U1.24 18.59,34.03 v16.57,36.05 | U2.7 v14.63,35.96
  Bottom 0.152: v14.63,35.96 | v14.63,35.96 16.48,35.96 v16.57,36.05
SCK  (via drill 0.3 pad 0.6)
  Top 0.152: v30.24,39.01 32.46,39.01 35.12,41.68 42.88,41.68 42.91,41.65 48.74,41.65 50.99,39.39 U$2.3 | U1.17 27.05,39.63 27.18,39.5 29,39.5 v29.02,39.51 | U$1.3 36.42,18.43 v36.46,18.47
  Bottom 0.152: v36.46,18.47 36.46,27 30.24,33.22 v30.24,39.01 30.24,39.51 | 30.24,39.51 v29.02,39.51 | J1.3 30.48,46.55 30.24,46.31 30.24,39.51
SCL
  Top 0.152: U1.28 30.08,31.67 29.54,31.13 19.62,31.13 17.46,28.96 13.8,28.96 11.53,31.24 11.53,35.39 11.7,35.56 13.37,35.56 U2.6 13.37,32.9 13.37,32 R4.1
SDA
  Top 0.152: U1.27 29.28,31.67 19.73,31.67 17.33,29.27 14.15,29.27 R3.1 14.15,30.73 14.04,30.73 12.1,32.67 U2.5
XLAT  (via drill 0.3 pad 0.6)
  Top 0.152: U1.13 30.08,39.82 29.09,38.83 v27.29,38.83 | U$1.30 25.8,18.43 25.5,18.73 v25.5,18.92
  Bottom 0.152: v25.5,18.92 25.5,37.04 v27.29,38.83
XTAL
  Top 0.254: C4.2 39.95,33.85 40.25,34.15 Y2.3 40.25,35.63 | 40.25,35.63 40.25,36.26 41.21,36.26 41.83,35.64 U$2.10 | 40.25,35.63 38.58,37.3 37.27,37.3 35.73,38.83 U1.7